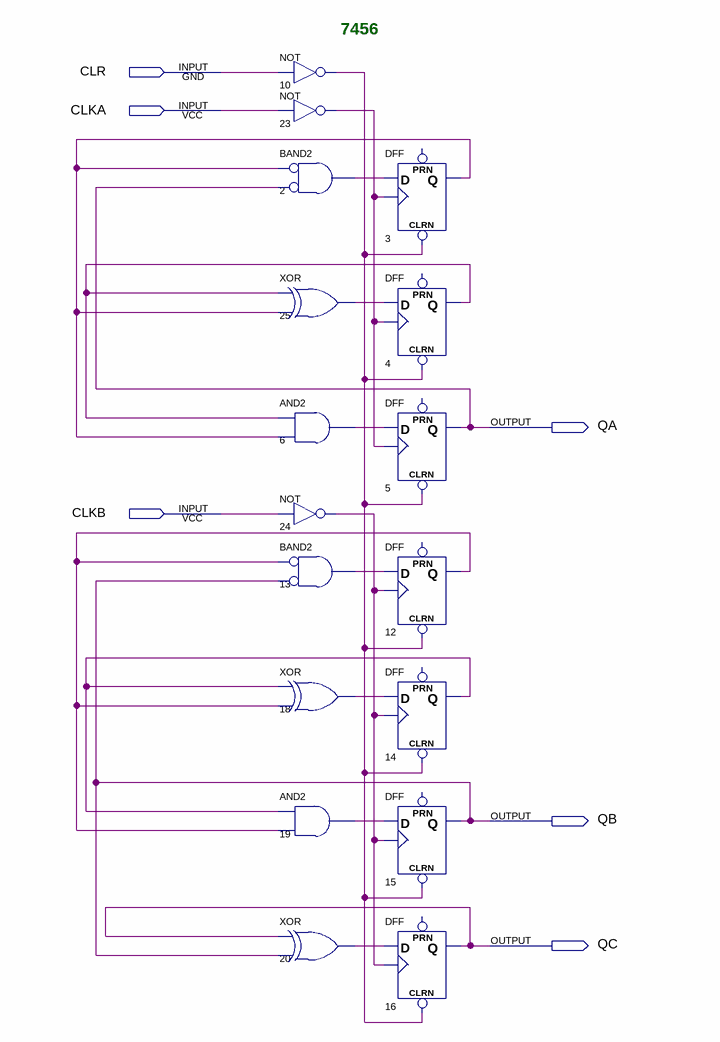
[diagram p0: schematic sheet]
// Quartus schematic 7456.bdf as structural Verilog: 17 symbols, 6 pins
module \7456  (
  input  CLR,
  input  CLKA,
  input  CLKB,
  output QA,
  output QB,
  output QC
);

  wire n2_out, n3_q, n4_q, n6_out, n10_out, n12_q, n13_out, n14_q, n18_out, n19_out, n20_out, n23_out,
       n24_out, n25_out;

  not u_10 (n10_out, CLR);
  not u_23 (n23_out, CLKA);
  and u_2 (n2_out, ~n3_q, ~QA);  // BAND2
  xor u_25 (n25_out, n4_q, n3_q);
  and u_6 (n6_out, n4_q, n3_q);
  not u_24 (n24_out, CLKB);
  and u_13 (n13_out, ~n12_q, ~QB);  // BAND2
  xor u_18 (n18_out, n14_q, n12_q);
  and u_19 (n19_out, n14_q, n12_q);
  xor u_20 (n20_out, QC, QB);
  DFF u_3 (.CLRN(n10_out), .CLK(n23_out), .D(n2_out), .Q(n3_q));  // open: PRN
  DFF u_4 (.CLRN(n10_out), .CLK(n23_out), .D(n25_out), .Q(n4_q));  // open: PRN
  DFF u_5 (.CLRN(n10_out), .CLK(n23_out), .D(n6_out), .Q(QA));  // open: PRN
  DFF u_12 (.CLRN(n10_out), .CLK(n24_out), .D(n13_out), .Q(n12_q));  // open: PRN
  DFF u_14 (.CLRN(n10_out), .CLK(n24_out), .D(n18_out), .Q(n14_q));  // open: PRN
  DFF u_15 (.CLRN(n10_out), .CLK(n24_out), .D(n19_out), .Q(QB));  // open: PRN
  DFF u_16 (.CLRN(n10_out), .CLK(n24_out), .D(n20_out), .Q(QC));  // open: PRN

  // Notes on the sheet:
  //   7456
endmodule
